# EasyEDA schematic SCH_ProMicro_evo2_2025-11-12.json
TITLE: ProMicro, Temp.sensor; REV: 1.0; Date: 2025-10-28; Sheet: 1/1; Drawn By: corlov; Company: Your Company
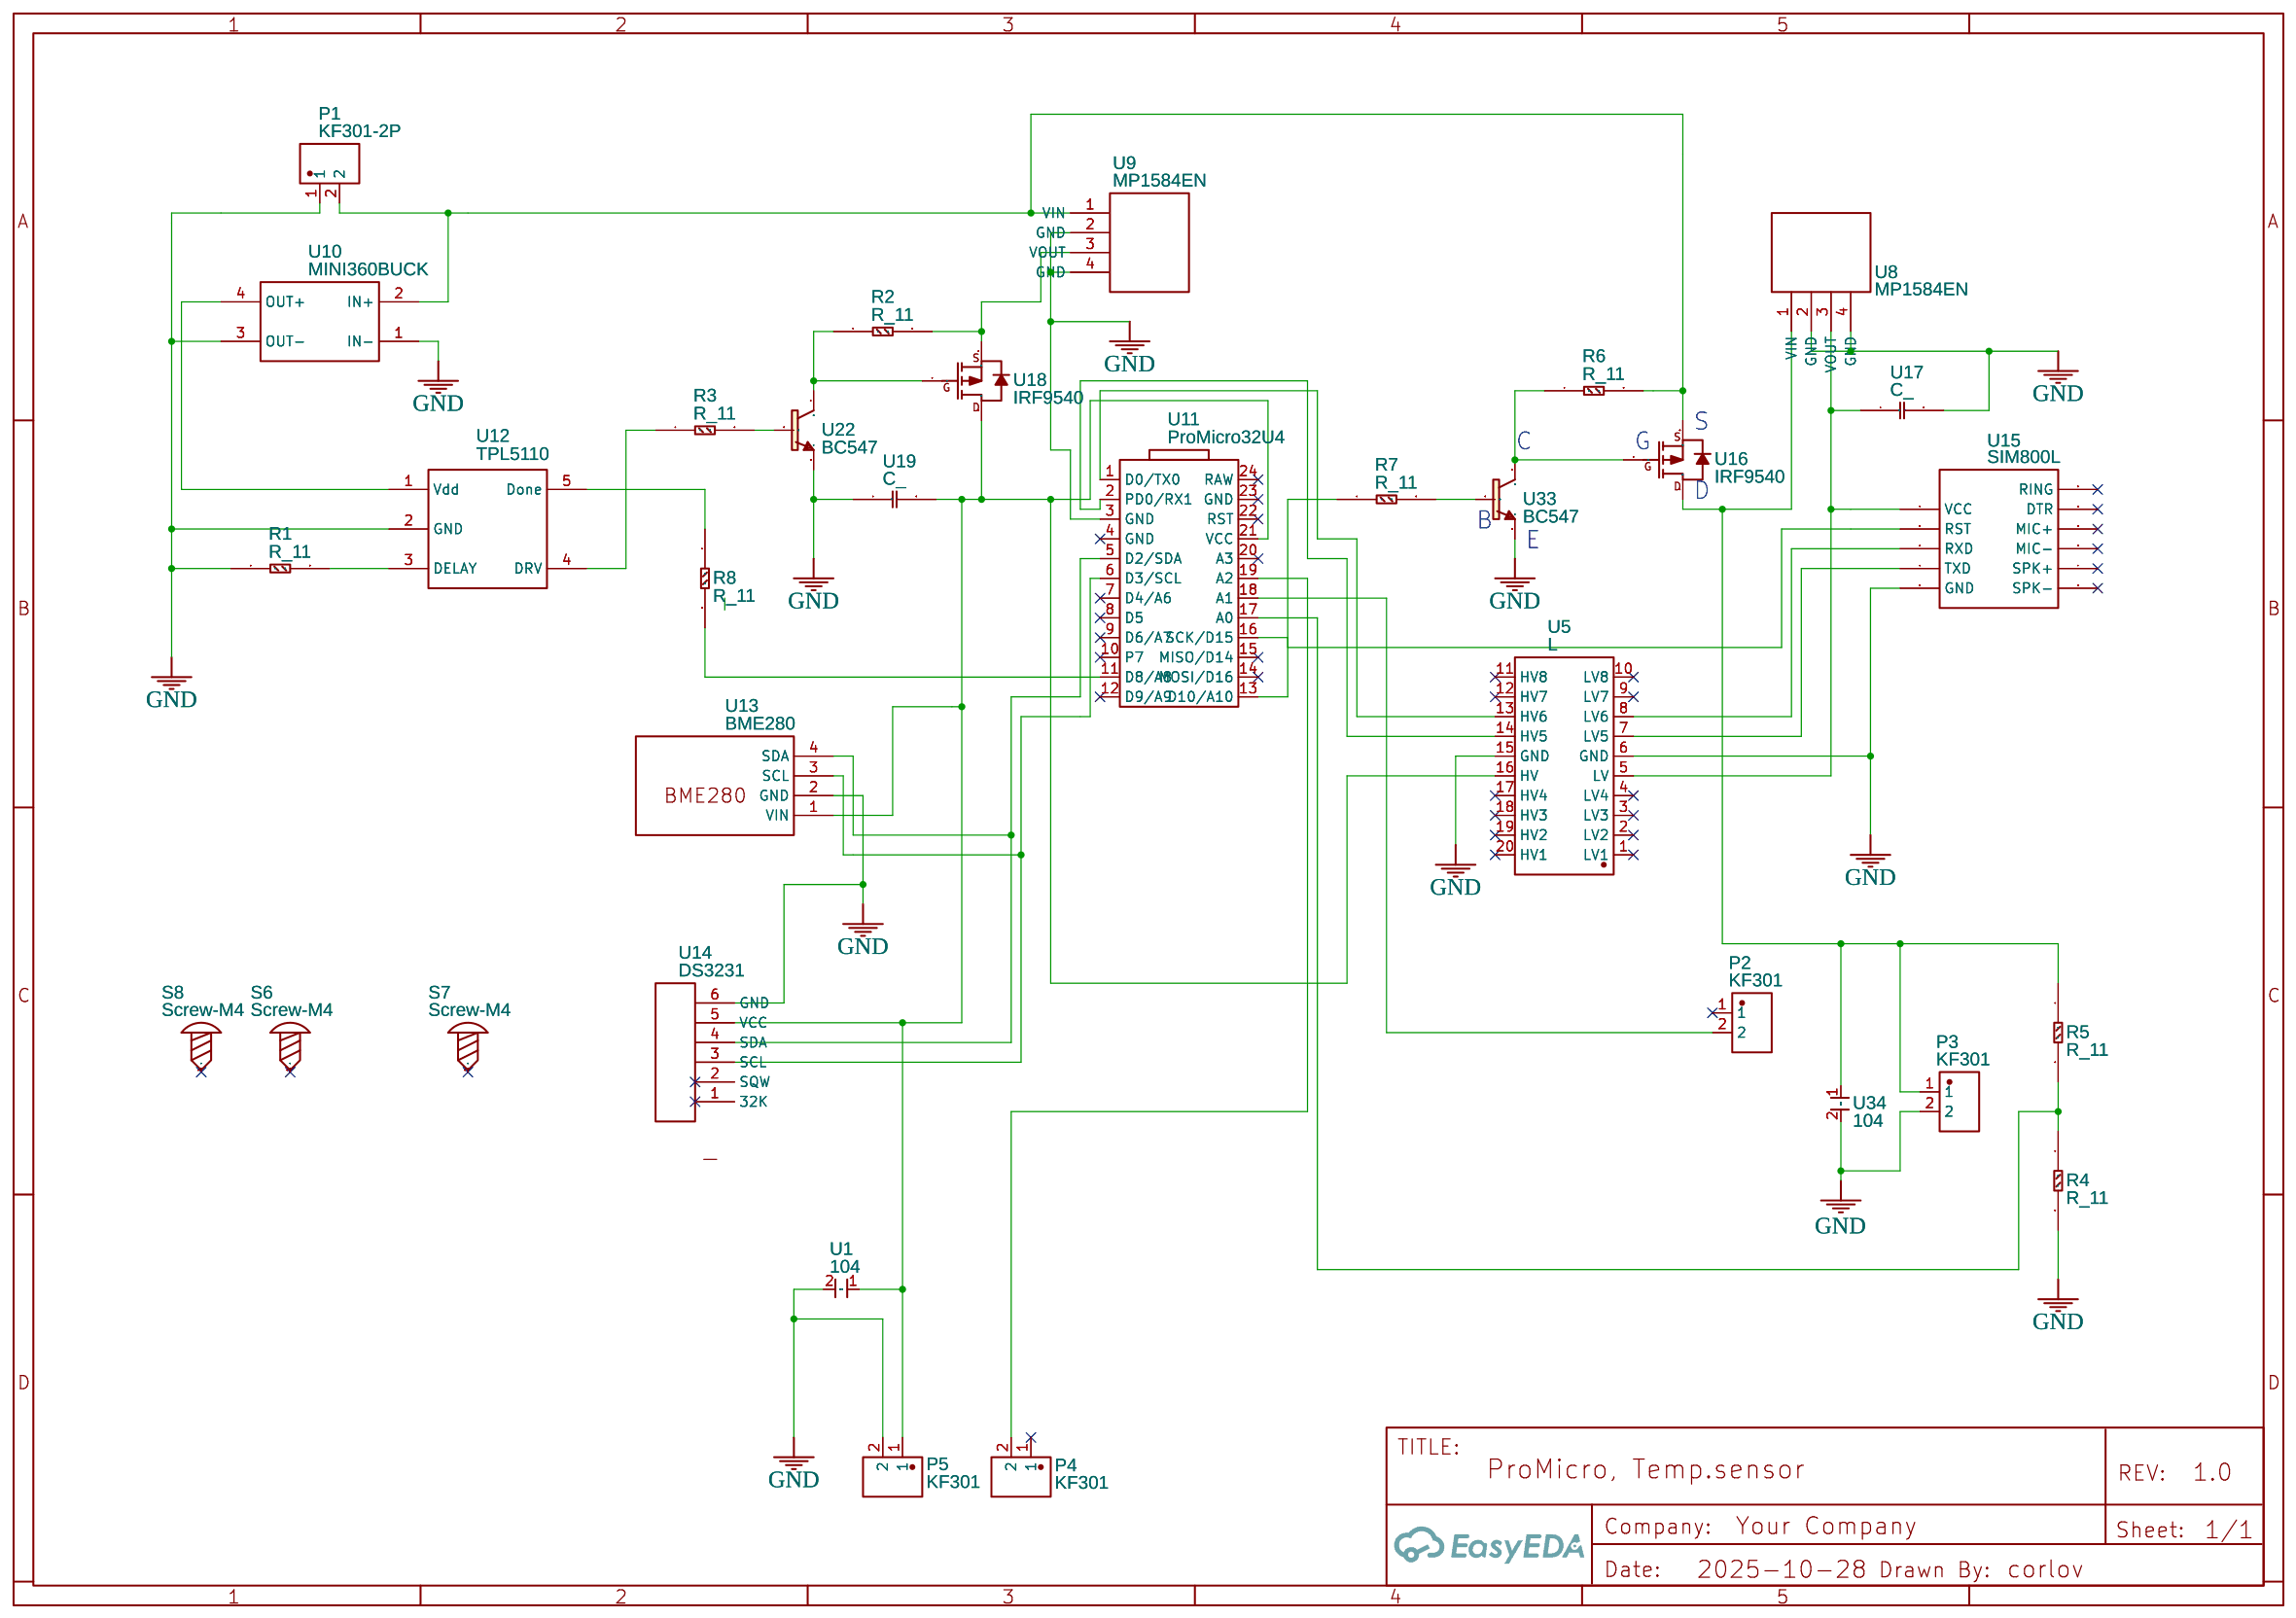
[diagram p0: schematic sheet]

## Parts
P1  KF301-2P  [CONN-TH_XY301V-A-5.0-2P]
P2  KF301  [CONN-TH_XY301V-A-5.0-2P]
P3  KF301  [CONN-TH_XY301V-A-5.0-2P]
P4  KF301  [CONN-TH_XY301V-A-5.0-2P]
P5  KF301  [CONN-TH_XY301V-A-5.0-2P]
R1  R_11  [R_0_125]
R2  R_11  [R_0_125]
R3  R_11  [R_0_125]
R4  R_11  [R_0_125]
R5  R_11  [R_0_125]
R6  R_11  [R_0_125]
R7  R_11  [R_0_125]
R8  R_11  [R_0_125]
S6  Screw-M4  [SCREW-M4]
S7  Screw-M4  [SCREW-M4]
S8  Screw-M4  [SCREW-M4]
U1  104  [104]
U5  L  [MPN-TH-20_L28.0-W14.0-P2.54-BL]
U8  MP1584EN  [MP1584EN]
U9  MP1584EN  [MP1584EN]
U10  MINI360BUCK  [MINI360BUCK]
U11  ProMicro32U4  [ARDUINOPROMICRO-PWB]
U12  TPL5110  [TPL5110]
U13  BME280  [BME280]
U14  DS3231  [DS3231]
U15  SIM800L  [SIM800L]
U16  IRF9540  [IRF9540]
U17  C_  [C_]
U18  IRF9540  [IRF9540]
U19  C_  [C_]
U22  BC547  [BC547 (2)]
U33  BC547  [BC547 (2)]
U34  104  [104]

## Library data of the parts
P1-P5 = KF301-2P VCC Y GND: Contributor: lcsc; Supplier: LCSC; Supplier Part: C9900016950; Manufacturer: null; Manufacturer Part: KF301-2P接线端子; JLCPCB Part Class: Extended Part
R1-R8 = R_: Contributor: verdenum
S6-S8 = Screw-M4: Contributor: EasyEDA
U1 U34 = 104: Manufacturer: Fe; Contributor: Guest
U5 = LEVEL CONVERTER 8: Contributor: LCSC; Supplier: LCSC; Supplier Part: C2829587; Manufacturer: null; Manufacturer Part: Level Converter 8; JLCPCB Part Class: Extended Part
U8 U9 = MP1584EN: Contributor: babeinlovexd
U10 = MINI360BUCK: Contributor: Andrey Fedorov; sourceId: FRLFXR8qI; Manufacturer Part: Mini360; link: http://ali.pub/399f0z
U11 = ProMicro32U4: Manufacturer: generic; Manufacturer Part: generic; Supplier Part: undefined; Contributor: pbinsted
U12 = ADAFRUIT TPL5110 BREAKOUT: Manufacturer Part: 3435; Supplier Part: 3435; Supplier: Adafruit; link: https://learn.adafruit.com/adafruit-tpl5110-power-timer-breakout?view=all; Contributor: Sdobout
U13 = BME280: Contributor: allvex
U14 = DS3231 upright: Contributor: poljak1141leonardo
U15 = SIM800L: Contributor: Rafa_2122
U16 U18 = IRF9540: Contributor: alesmo
U17 U19 = C_: Contributor: verdenum
U22 U33 = BC547: Contributor: joaodahlke

## Nets
GND: P1.1 P3.2 P5.2 R1.1 R4.2 U1.2 U5.6(GND) U5.15(GND) U8.2(GND) U8.4(GND) U9.2(GND) U9.4(GND) U10.1(IN-) U10.3(OUT-) U11.3(GND) U12.2(GND) U13.2(GND) U14.6(GND) U15.5(GND) U17.2 U19.1 U22.3(E) U33.3(E) U34.2
Net-(P1-2): P1.2 R6.2 U9.1(VIN) U10.2(IN+) U16.3(S)
Net-(P2-2): P2.2 U11.18(A1)
Net-(P3-1): P3.1 R5.1 U8.1(VIN) U16.2(D) U34.1
Net-(P4-2): P4.2 U11.19(A2)
Net-(P5-1): P5.1 U1.1 U5.16(HV) U11.21(VCC) U13.1(VIN) U14.5(VCC) U18.2(D) U19.2
Net-(R1-2): R1.2 U12.3(DELAY)
Net-(R2-1): R2.1 U18.1(G) U22.1(C)
Net-(R2-2): R2.2 U9.3(VOUT) U18.3(S)
Net-(R3-1): R3.1 U12.4(DRV)
Net-(R3-2): R3.2 U22.2(B)
Net-(R4-1): R4.1 R5.2 U11.17(A0)
Net-(R6-1): R6.1 U16.1(G) U33.1(C)
Net-(R7-1): R7.1 U11.13(D10/A10)
Net-(R7-2): R7.2 U33.2(B)
Net-(R8-1): R8.1 U12.5(Done)
Net-(R8-2): R8.2 U11.11(D8/A8)
Net-(U5-5): U5.5(LV) U8.3(VOUT) U15.1(VCC) U17.1
Net-(U5-7): U5.7(LV5) U15.4(TXD)
Net-(U5-8): U5.8(LV6) U15.3(RXD)
Net-(U5-13): U5.13(HV6) U11.1(D0/TX0)
Net-(U5-14): U5.14(HV5) U11.2(PD0/RX1)
Net-(U10-4): U10.4(OUT+) U12.1(Vdd)
Net-(U11-5): U11.5(D2/SDA) U13.4(SDA) U14.4(SDA)
Net-(U11-6): U11.6(D3/SCL) U13.3(SCL) U14.3(SCL)
Net-(U11-16): U11.16(SCK/D15) U15.2(RST)

Not connected (* = marked no-connect by the designer): P2 1*; P4 1*; S6 1*; S7 1*; S8 1*; U5 1(LV1)* 2(LV2)* 3(LV3)* 4(LV4)* 9(LV7)* 10(LV8)* 11(HV8)* 12(HV7)* 17(HV4)* 18(HV3)* 19(HV2)* 20(HV1)*; U11 4(GND)* 7(D4/A6)* 8(D5)* 9(D6/A7)* 10(P7)* 12(D9/A9)* 14(MOSI/D16)* 15(MISO/D14)* 20(A3)* 22(RST)* 23(GND)* 24(RAW)*; U14 1(32K)* 2(SQW)*; U15 6(SPK-)* 7(SPK+)* 8(MIC-)* 9(MIC+)* 10(DTR)* 11(RING)*

## Notes on the sheet
- S
- C
- G
- D
- B
- E
